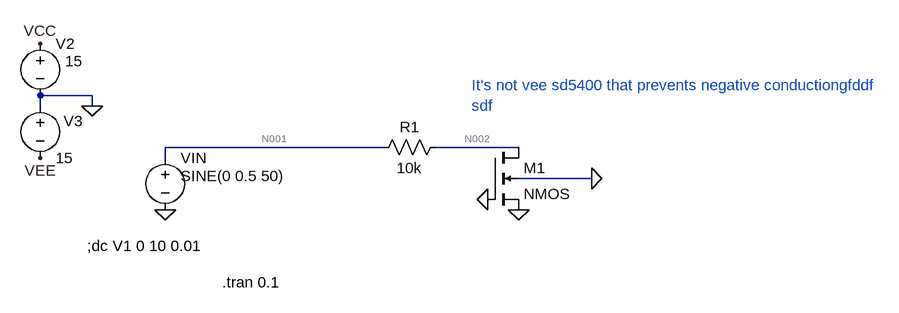
[diagram p0: schematic Draft24.asc]
Draft24.asc, the LTspice schematic file:
Version 4
SHEET 1 1212 680
WIRE -64 32 -144 32
WIRE -144 48 -144 32
WIRE -64 48 -64 32
WIRE 384 112 48 112
WIRE 592 112 464 112
WIRE 48 128 48 112
WIRE 704 160 592 160
FLAG 48 208 0
FLAG -64 48 0
FLAG -144 -48 VCC
FLAG -144 128 VEE
FLAG 592 208 0
FLAG 704 160 0
FLAG 544 192 0
SYMBOL voltage 48 112 R0
WINDOW 123 0 0 Left 0
WINDOW 39 0 0 Left 0
WINDOW 3 24 44 Left 2
SYMATTR Value SINE(0 0.5 50)
SYMATTR InstName VIN
SYMBOL voltage -144 -64 R0
WINDOW 123 0 0 Left 0
WINDOW 39 0 0 Left 0
WINDOW 3 38 43 Left 2
SYMATTR Value 15
SYMATTR InstName V2
SYMBOL voltage -144 32 R0
WINDOW 123 0 0 Left 0
WINDOW 39 0 0 Left 0
WINDOW 0 36 39 Left 2
SYMATTR InstName V3
SYMATTR Value 15
SYMBOL res 480 96 R90
WINDOW 0 0 56 VBottom 2
WINDOW 3 32 56 VTop 2
SYMATTR InstName R1
SYMATTR Value 10k
SYMBOL nmos4 544 112 R0
SYMATTR InstName M1
TEXT -72 264 Left 2 !;dc V1 0 10 0.01
TEXT 136 320 Left 2 !.tran 0.1
TEXT 520 16 Left 2 ;It's not vee sd5400 that prevents negative conductiongfddf\nsdf

The netlist it stands for:
* Draft24.asc
VIN N001 0 SINE(0 0.5 50)
V2 VCC 0 15
V3 0 VEE 15
R1 N002 N001 10k
M1 N002 0 0 0 NMOS
.model NMOS NMOS
.model PMOS PMOS
.lib standard.mos
;dc V1 0 10 0.01
.tran 0.1
* It's not vee sd5400 that prevents negative conductiongfddf
* sdf
.backanno
.end

* Results of the author's LTspice run, read from the files saved beside the schematic
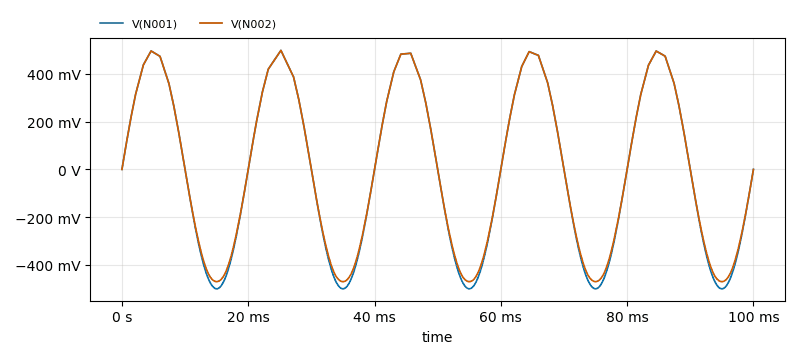
[diagram p1: Transient Analysis of Draft24.asc, plotted from the saved traces]
* Transient Analysis, 1 run:
*   V(N001): min -500 mV, max 498.8 mV, average -2.21 mV, rms 351.7 mV, last 0 V
*   V(N002): min -470 mV, max 498.7 mV, average 4.3 mV, rms 343.8 mV, last 0 V